# EasyEDA schematic Smart-Home.json
TITLE: Schematic; REV: 1.0; Date: 2021-05-30; Sheet: 1/1; Company: SIT210
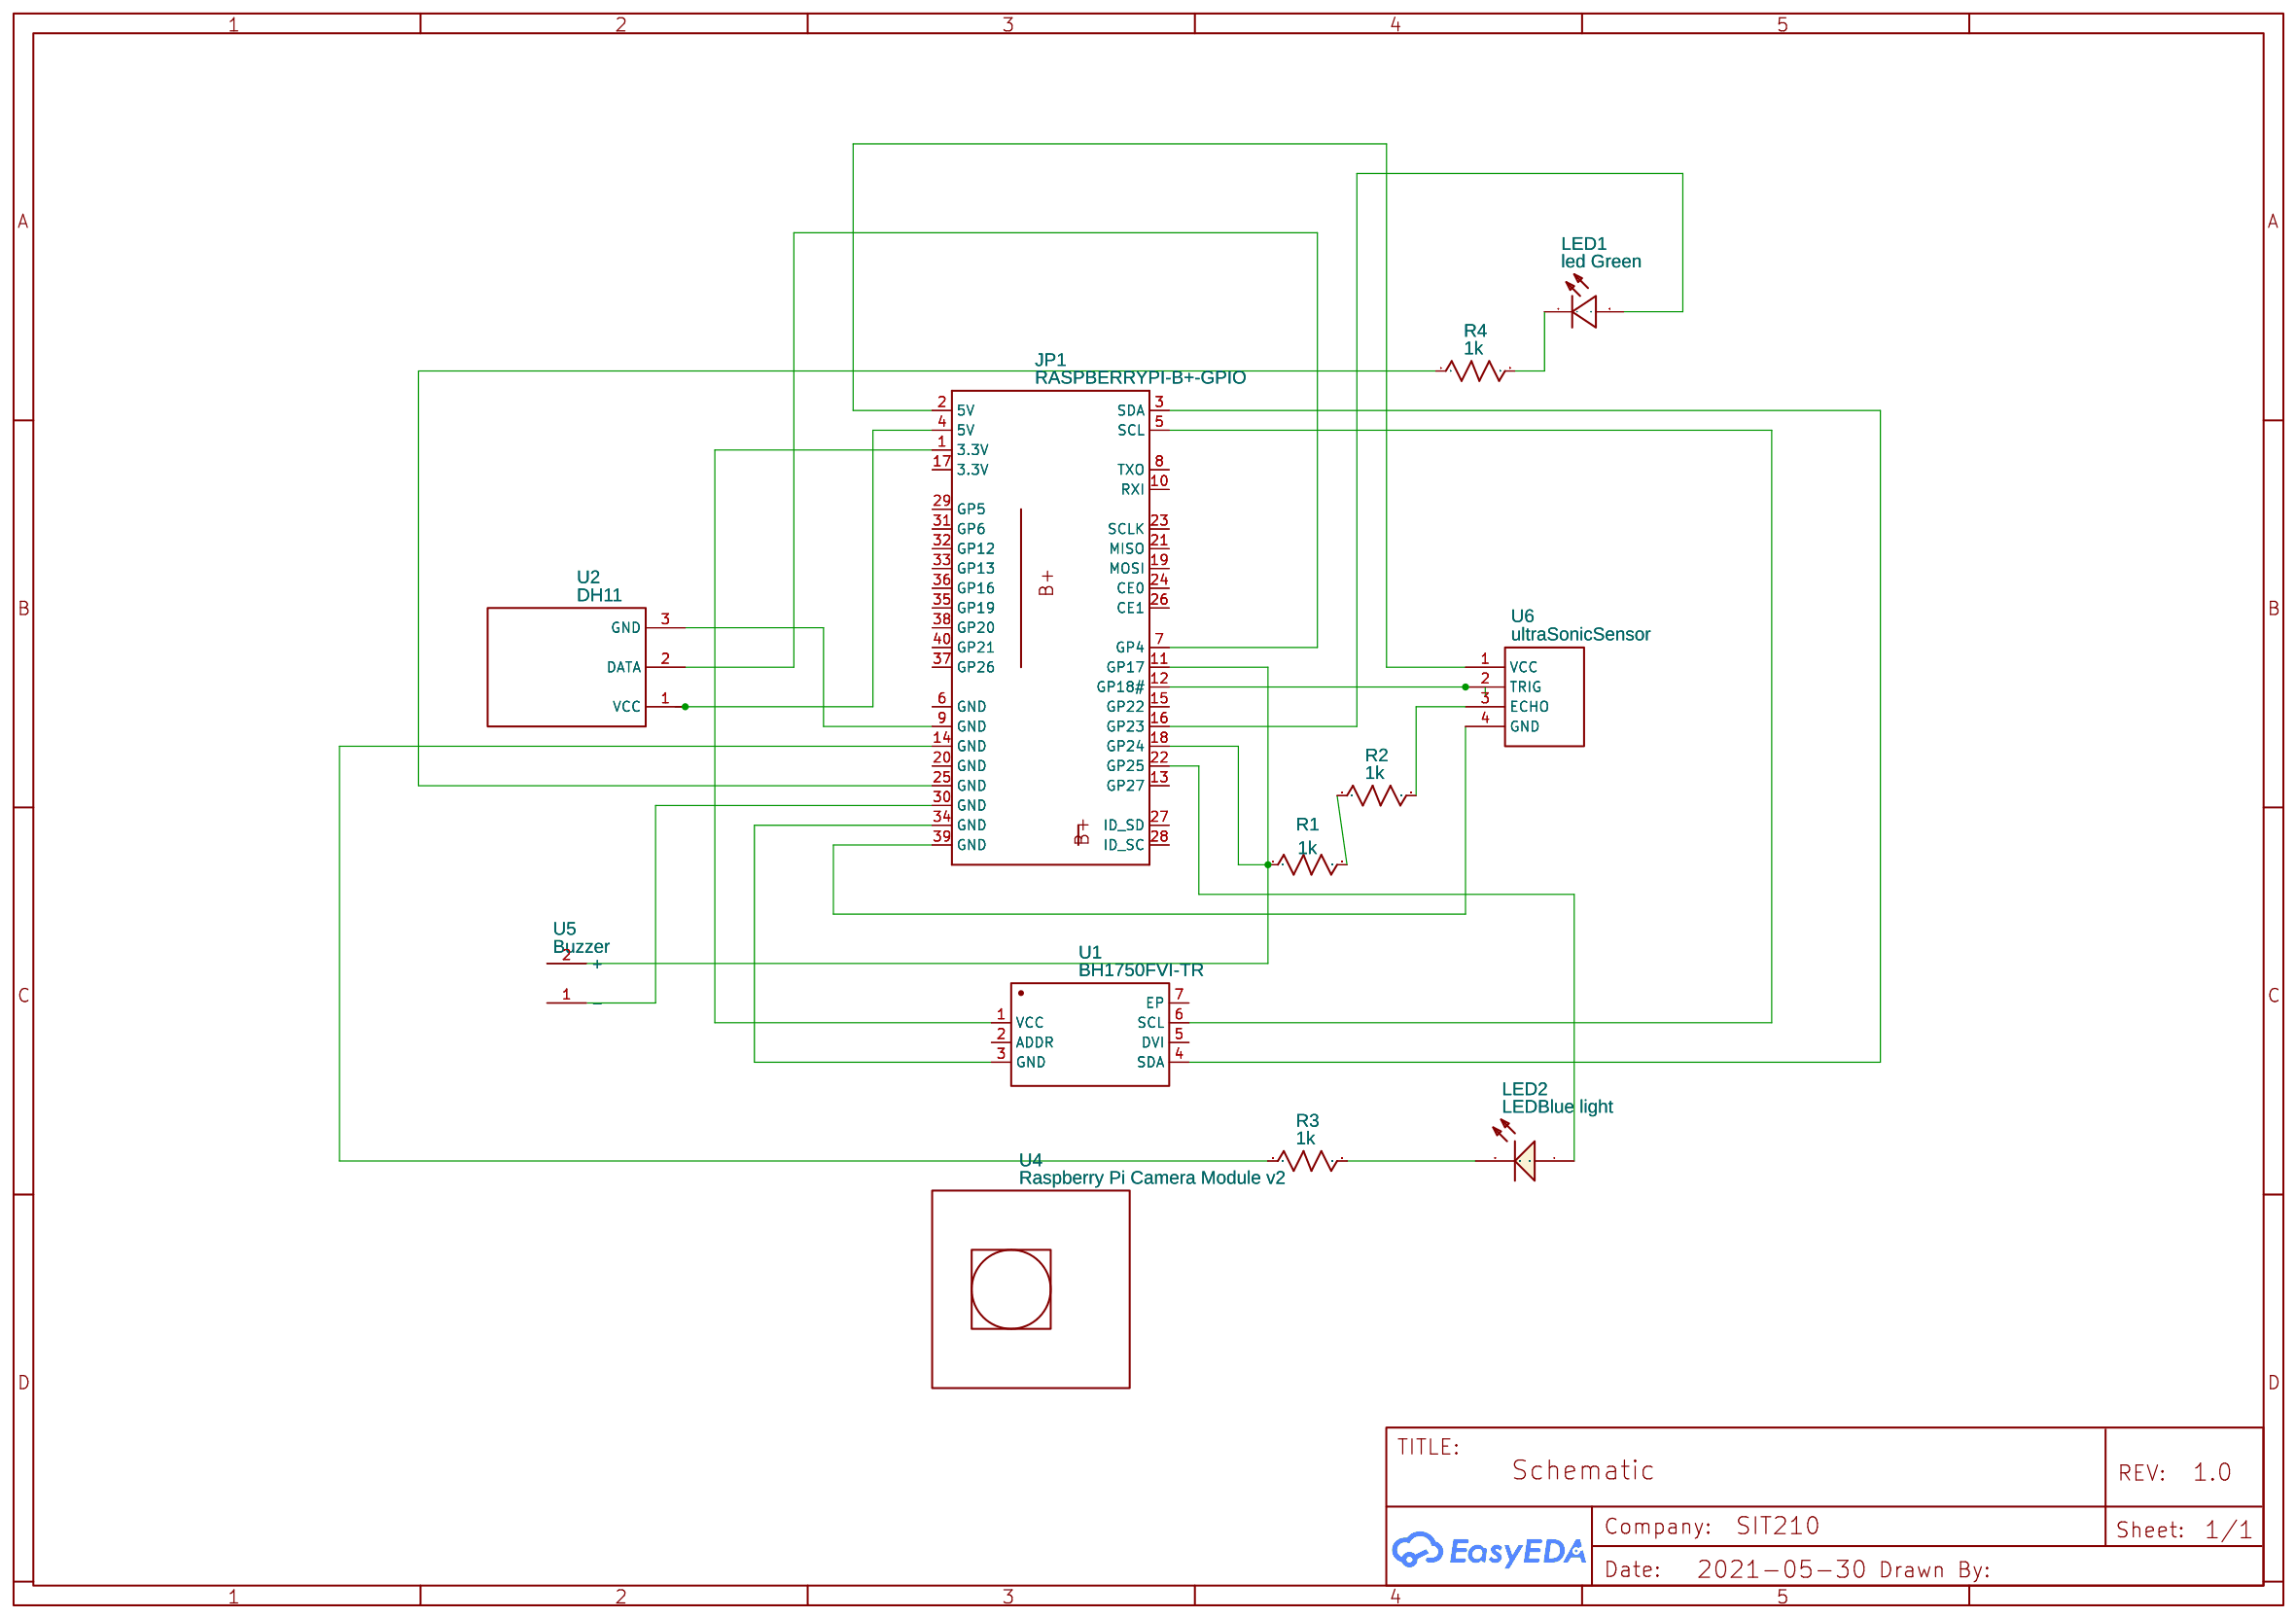
[diagram p0: schematic sheet]

## Parts
JP1  RASPBERRYPI-B+-GPIO  [2X20-SHROUDED]
LED1  led Green  [LED1206-RD]
LED2  LEDBlue light  [LED-SMD_L3.6-W2.9-R-RD]
R1  1k  [R0603]
R2  1k  [R0603]
R3  1k  [R0603]
R4  1k  [R0603]
U1  BH1750FVI-TR  [WSOF-6_L2.6-W1.6-P0.50-TL-EP]
U2  DH11  [DH11]
U4  Raspberry Pi Camera Module v2  [RASPBERRY PI CAMERA MODULE V2]
U5  Buzzer  [BUZZER]
U6  ultraSonicSensor  [ULTRASONIC]

## Library data of the parts
JP1 = RASPBERRYPI-B+-GPIO: Raspberry Pi B+ GPIO Header; Contributor: SparkFun
LED1 = led Green: Supplier: LCSC; Manufacturer: KENTO; Supplier Part: C14641; JLCPCB Part Class: Extended Part
LED2 = LEDBlue light: Supplier Part: C69273; Supplier: LCSC; Manufacturer: ReliaPro; JLCPCB Part Class: Extended Part
R1-R4 = R_0603_US: Contributor: LCEDA_Lib
U1 = BH1750FVI-TR: Supplier: LCSC; Manufacturer: ROHM; Supplier Part: C78960; Paste Type: Extended Part; JLCPCB Part Class: Extended Part
U2 = DH11: Manufacturer Part: New SchematicLib; Contributor: 1007606713
U4 = Raspberry Pi Camera Module v2: Contributor: tunx404
U5 = Buzzer: Contributor: lensingmj
U6 = ultraSonicSensor: Contributor: mamanbudiman

## Nets
Net-(JP1-1): JP1.1(3.3V) U1.1(VCC)
Net-(JP1-2): JP1.2(5V) U6.1(VCC)
Net-(JP1-3): JP1.3(SDA) U1.4(SDA)
Net-(JP1-4): JP1.4(5V) U2.1(VCC)
Net-(JP1-5): JP1.5(SCL) U1.6(SCL)
Net-(JP1-7): JP1.7(GP4) U2.2(DATA)
Net-(JP1-9): JP1.9(GND) U2.3(GND)
Net-(JP1-11): JP1.11(GP17) JP1.18(GP24) R1.1 U5.2(+)
Net-(JP1-12): JP1.12(GP18#) U6.2(TRIG)
Net-(JP1-14): JP1.14(GND) R3.1
Net-(JP1-16): JP1.16(GP23) LED1.2(+)
Net-(JP1-22): JP1.22(GP25) LED2.1
Net-(JP1-25): JP1.25(GND) R4.1
Net-(JP1-30): JP1.30(GND) U5.1(-)
Net-(JP1-34): JP1.34(GND) U1.3(GND)
Net-(JP1-39): JP1.39(GND) U6.4(GND)
Net-(LED1-1): LED1.1(-) R4.2
Net-(LED2-2): LED2.2 R3.2
Net-(R1-2): R1.2 R2.1
Net-(R2-2): R2.2 U6.3(ECHO)

Not connected (* = marked no-connect by the designer): JP1 6(GND) 8(TXO) 10(RXI) 13(GP27) 15(GP22) 17(3.3V) 19(MOSI) 20(GND) 21(MISO) 23(SCLK) 24(CE0) 26(CE1) 27(ID_SD) 28(ID_SC) 29(GP5) 31(GP6) 32(GP12) 33(GP13) 35(GP19) 36(GP16) 37(GP26) 38(GP20) 40(GP21); U1 2(ADDR) 5(DVI) 7(EP)
